# EAGLE design VRegulatorBoard (EAGLE 7.2.0)
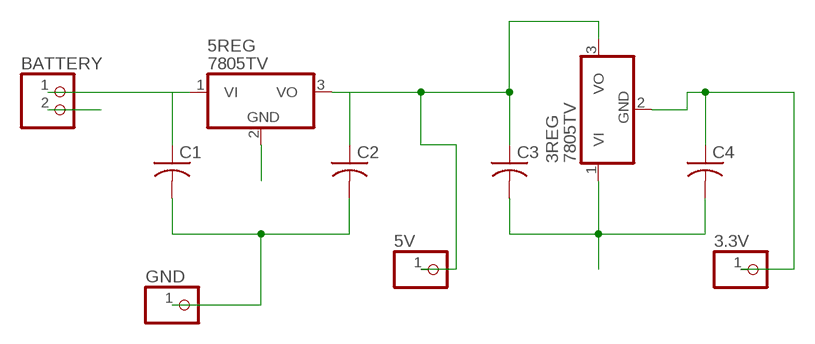
[diagram p0: schematic, sheet 1]

## Parts
3.3V  PINHD-1X1  [1X01]
3REG  7805TV  [TO220V]
5REG  7805TV  [TO220V]
5V  PINHD-1X1  [1X01]
BATTERY  PINHD-1X2  [1X02]
C1  C-US050-025X075  [C050-025X075]
C2  C-US050-025X075  [C050-025X075]
C3  C-US050-025X075  [C050-025X075]
C4  C-US050-025X075  [C050-025X075]
GND  PINHD-1X1  [1X01]

## Nets
5REGULATOR: 5REG.1(VI) BATTERY.1 C1.1
GND: 3REG.1(VI) 5REG.2(GND) BATTERY.2 C1.2 C2.2 C3.2 C4.2 GND.1
N$2: 3REG.3(VO) 5REG.3(VO) 5V.1 C2.1 C3.1
N$4: 3.3V.1 3REG.2(GND) C4.1

## Library data of the parts
3.3V 5V GND = pinhead:PINHD-1X1: PIN HEADER
3REG 5REG = linear:78*: Positive VOLTAGE REGULATOR Source: http://cache.national.com/ds/LM/LM78L05.pdf http://www.fairchildsemi.com/ds/LM/LM7805.pdf
BATTERY = pinhead:PINHD-1X2: PIN HEADER
C1-C4 = adafruit:C-US: CAPACITOR, American symbol

## Board
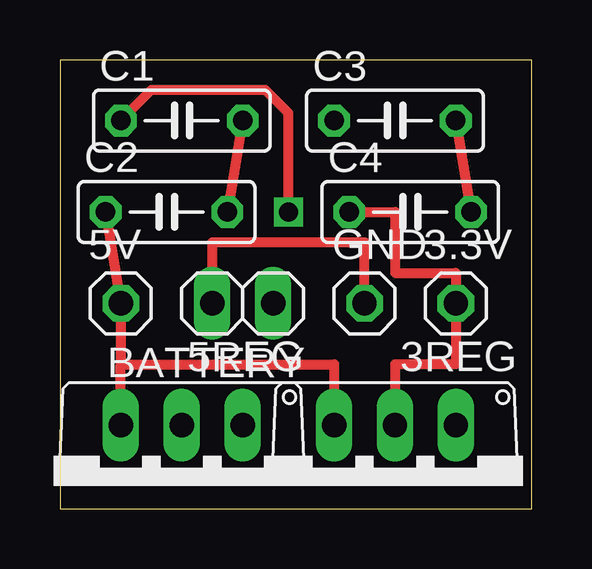
[diagram p1: board, top side]
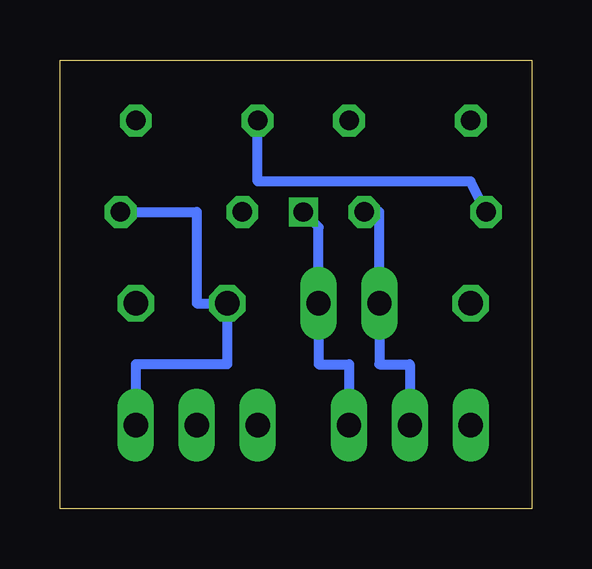
[diagram p2: board, bottom side, seen from below]

Size 19.67 x 18.72 mm. Coordinates in mm from the lower left corner, seen from the top.
Outline: 0,0 19.67,0 19.67,18.72 0,18.72 0,0
Copper layers (1*16): Top 0.035mm / dielectric 1.5mm / Bottom 0.035mm
Design rules "default": minimum track width 10mil, minimum drill 24mil, track to track 8mil, track to pad 8mil, pad to pad 8mil, via to via 8mil, smd to smd 8mil, copper to edge 40mil, drill to drill 8mil, minimum pad ring 10mil, minimum via ring 8mil, stop-mask expansion 4mil, vias tented up to drill 0mil, thermal gap 10mil

### Footprints (pad centres in the part's own frame; a part is rotated, then mirrored left to right if it is on the bottom)
1X01 = drill 1.016 octagon: 1 0,0
TO220V = drill 1.016 long: 1 -2.54,-2.54; 2 0,-2.54; 3 2.54,-2.54
1X02 = drill 1.016 long: 1 -1.27,0; 2 1.27,0
C050-025X075 = drill 0.813 octagon: 1 -2.54,0; 2 2.54,0

### Placement (x,y rotation side)
3.3V  16.51,8.57 0 top
3REG  13.97,0.95 180 top
5REG  5.08,0.95 180 top
5V  2.54,8.57 0 top
BATTERY  7.62,8.57 180 top
C1  5.08,16.19 0 top
C2  4.45,12.38 0 top
C3  13.97,16.19 0 top
C4  14.61,12.38 0 top
GND  12.7,8.57 0 top

### Tracks (layer width: path | path; a pad name or v marks a point on that pad's centre or on a via)
5REGULATOR  (via drill 0.8)
  Top 0.406: v9.53,12.38 9.53,16.51 8.57,17.46 3.81,17.46 C1.1
  Bottom 0.406: 5REG.1 7.62,6.03 8.89,6.03 BATTERY.1 8.89,11.75 v9.53,12.38
GND
  Top 0.406: C1.2 C2.2 | C3.2 C4.2 | GND.1 12.7,11.11 6.35,11.11 BATTERY.2
  Bottom 0.406: C4.2 13.97,12.38 13.97,8.57 GND.1 12.7,6.03 16.51,6.03 3REG.1 | C2.2 6.35,12.38 BATTERY.2 6.35,6.03 5.08,6.03 5REG.2
N$2
  Top 0.406: C2.1 5V.1 2.54,6.03 | 5REG.3 2.54,6.03 | 2.54,6.03 11.43,6.03 3REG.3
  Bottom 0.406: C2.1 2.54,13.65 11.43,13.65 C3.1
N$4
  Top 0.406: 3REG.2 13.97,6.03 16.51,6.03 3.3V.1 16.51,9.84 13.97,9.84 13.97,12.38 C4.1